# EasyEDA schematic SCH_ESP-RotaryCell_Main_Carrier_RevA0.json
TITLE: Sheet_1; REV: 1.0; Date: 2026-08-07; Sheet: 1/1; Drawn By: evilroot; Company: Your Company
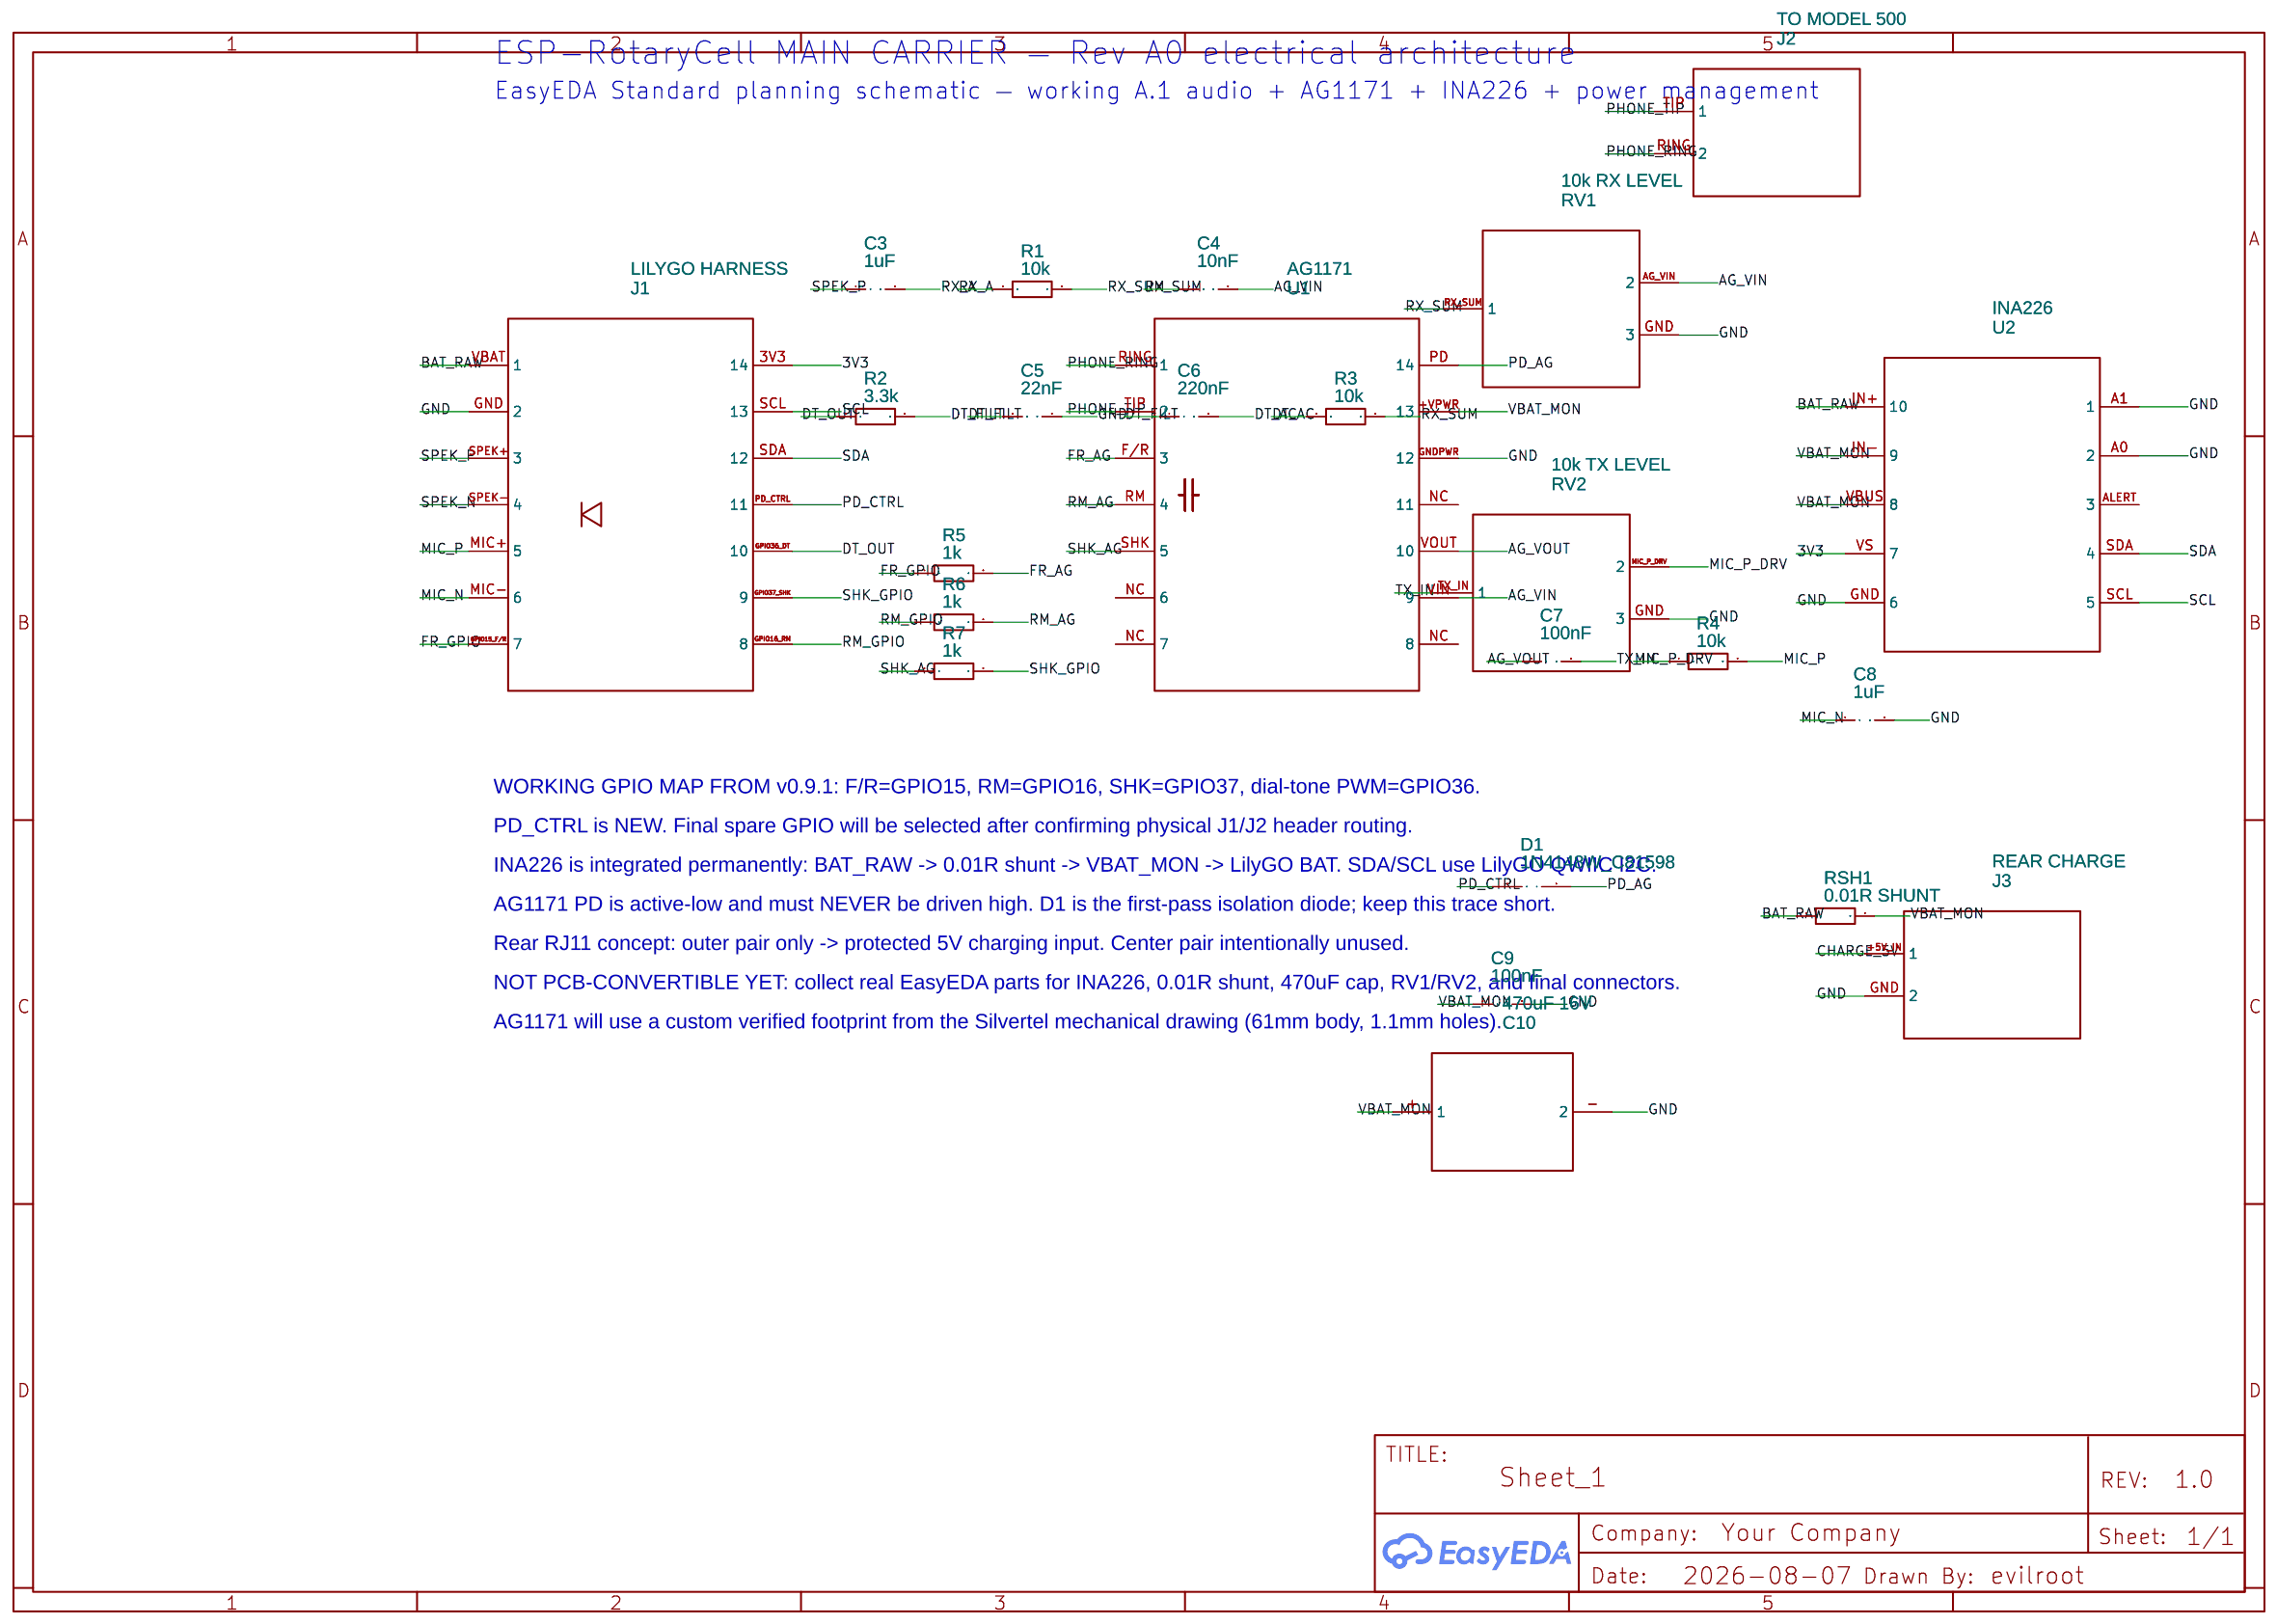
[diagram p0: schematic sheet]

## Parts
C3  1uF  [C0805]
C4  10nF  [C0805]
C5  22nF  [C0805]
C6  220nF  [C0805]
C7  100nF  [C0805]
C8  1uF  [C0805]
C9  100nF  [C0805]
C10  470uF 16V  [RADIAL_470UF_TBD]
D1  1N4148W_C81598  [SOD-123F_L2.7-W1.6-LS3.8-RD]
J1  LILYGO HARNESS  [PROVISIONAL_14P_HARNESS]
J2  TO MODEL 500  [PROVISIONAL_2P]
J3  REAR CHARGE  [PROVISIONAL_2P]
R1  10k  [R0805]
R2  3.3k  [R0805]
R3  10k  [R0805]
R4  10k  [R0805]
R5  1k  [R0805]
R6  1k  [R0805]
R7  1k  [R0805]
RSH1  0.01R SHUNT  [R0805]
RV1  10k RX LEVEL  [TRIMMER_TBD]
RV2  10k TX LEVEL  [TRIMMER_TBD]
U1  AG1171  [CUSTOM_AG1171_VERTICAL]
U2  INA226  [VSSOP-10]

## Library data of the parts
C3-C9 = C0805C104K5RACTU: Contributor: LCSC; Supplier: LCSC; Supplier Part: C75414; JLCPCB Part Class: Extended Part
C10 J1-J3 RV1 RV2 U1 U2 = -: Contributor: OpenAI
D1 = 1N4148W_C81598: Supplier: LCSC; Manufacturer: ST(先科); Manufacturer Part: 1N4148W; Supplier Part: C81598; JLCPCB Part Class: Basic Part
R1-R7 = 0805W8F2201T5E: Supplier: LCSC; Supplier Part: C17520; JLCPCB Part Class: Basic Part
RSH1 = CR0805F827R0G: Supplier: LCSC; Supplier Part: C101623; JLCPCB Part Class: Extended Part

## Nets
3V3: J1.3V3(14) U2.VS(7)
GND: C5.2 C8.2 C9.2 C10.-(2) J1.GND(2) J3.GND(2) RV1.GND(3) RV2.GND(3) U1.GNDPWR(12) U2.A0(2) U2.A1(1) U2.GND(6)
VBAT_MON: C9.1 C10.+(1) RSH1.2 U1.+VPWR(13) U2.IN-(9) U2.VBUS(8)
AG_VIN: C4.2 RV1.AG_VIN(2) U1.VIN(9)
AG_VOUT: C7.1 U1.VOUT(10)
BAT_RAW: J1.VBAT(1) RSH1.1 U2.IN+(10)
CHARGE_5V: J3.+5V_IN(1)
DT_AC: C6.2 R3.1
DT_FILT: C5.1 C6.1 R2.2
DT_OUT: J1.GPIO36 DT(10) R2.1
FR_AG: R5.2 U1.F/R(3)
FR_GPIO: J1.GPIO15 F/R(7) R5.1
MIC_N: C8.1 J1.MIC-(6)
MIC_P: J1.MIC+(5) R4.2
MIC_P_DRV: R4.1 RV2.MIC_P_DRV(2)
PD_AG: D1.2(A) U1.PD(14)
PD_CTRL: D1.1(K) J1.PD_CTRL(11)
PHONE_RING: J2.RING(2) U1.RING(1)
PHONE_TIP: J2.TIP(1) U1.TIP(2)
RM_AG: R6.2 U1.RM(4)
RM_GPIO: J1.GPIO16 RM(8) R6.1
RX_A: C3.2 R1.1
RX_SUM: C4.1 R1.2 R3.2 RV1.RX_SUM(1)
SCL: J1.SCL(13) U2.SCL(5)
SDA: J1.SDA(12) U2.SDA(4)
SHK_AG: R7.1 U1.SHK(5)
SHK_GPIO: J1.GPIO37 SHK(9) R7.2
SPEK_N: J1.SPEK-(4)
SPEK_P: C3.1 J1.SPEK+(3)
TX_IN: C7.2 RV2.TX_IN(1)

Not connected (* = marked no-connect by the designer): U1 NC(8); U2 ALERT(3)

## Notes on the sheet
- ESP-RotaryCell MAIN CARRIER — Rev A0 electrical architecture
- EasyEDA Standard planning schematic — working A.1 audio + AG1171 + INA226 + power management
- WORKING GPIO MAP FROM v0.9.1: F/R=GPIO15, RM=GPIO16, SHK=GPIO37, dial-tone PWM=GPIO36.
- PD_CTRL is NEW. Final spare GPIO will be selected after confirming physical J1/J2 header routing.
- INA226 is integrated permanently: BAT_RAW -> 0.01R shunt -> VBAT_MON -> LilyGO BAT. SDA/SCL use LilyGO QWIIC I2C.
- AG1171 PD is active-low and must NEVER be driven high. D1 is the first-pass isolation diode; keep this trace short.
- Rear RJ11 concept: outer pair only -> protected 5V charging input. Center pair intentionally unused.
- NOT PCB-CONVERTIBLE YET: collect real EasyEDA parts for INA226, 0.01R shunt, 470uF cap, RV1/RV2, and final connectors.
- AG1171 will use a custom verified footprint from the Silvertel mechanical drawing (61mm body, 1.1mm holes).
